# Altium schematic sheet Font.SchDoc
size A4; SheetNumber: 2; SheetTotal: 3
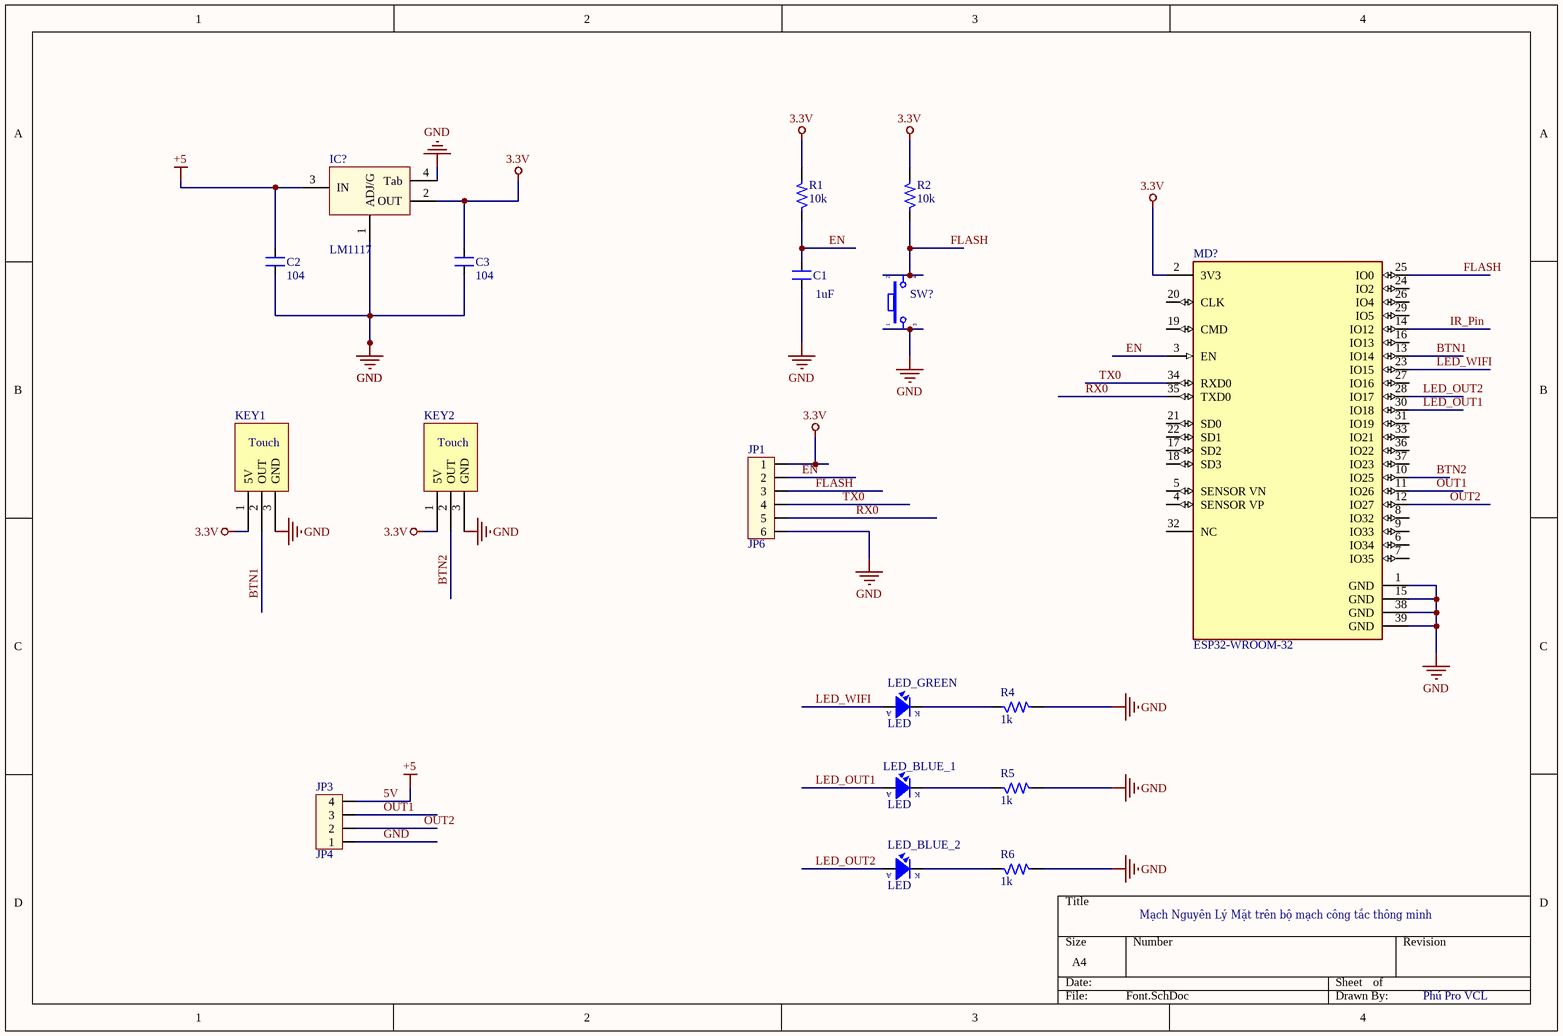
[diagram p0: Font.SchDoc]

## Parts
C1  1uF  [CM-0805]
C2  104  [CM-0805]
C3  104  [CM-0805]
IC?  LM1117  [SOT223-4N]
JP1  JP6  [CON6]
JP3  JP4  [CON4]
KEY1  Component_1  [test]  (value not drawn)
KEY2  Component_1  [test]  (value not drawn)
LED_BLUE_1  LED  [LED_SMD]
LED_BLUE_2  LED  [LED_SMD]
LED_GREEN  LED  [LED_SMD]
MD?  ESP32-WROOM-32  [FP-ESP32-WROOM-32-MFG]
R1  10k  [RM-0805]
R2  10k  [RM-0805]
R4  1k  [RM-0805]
R5  1k  [RM-0805]
R6  1k  [RM-0805]
SW?  SW  [SW4_SMD]  (value not drawn)

## Nets
3.3V: C3.2 IC?.2(OUT) JP1.1 KEY1.1(5V) KEY2.1(5V) MD?.2(3V3) R1.2 R2.2
5V: C2.2 IC?.3(IN) JP3.4  [also labelled +5]
GND: C1.1 C2.1 C3.1 IC?.1(ADJ/G) IC?.4(Tab) JP1.6 JP3.1 KEY1.3(GND) KEY2.3(GND) MD?.1(GND) MD?.15(GND) MD?.38(GND) MD?.39(GND) R4.2 R5.2 R6.2 SW?.1 SW?.3
BTN1: KEY1.2(OUT) MD?.13(IO14)
BTN2: KEY2.2(OUT) MD?.10(IO25)
EN: C1.2 JP1.2 MD?.3(EN) R1.1
FLASH: JP1.3 MD?.25(IO0) R2.1 SW?.2 SW?.4
IR_Pin: MD?.14(IO12)
LED_OUT1: LED_BLUE_1.1(A) MD?.30(IO18)
LED_OUT2: LED_BLUE_2.1(A) MD?.28(IO17)
LED_WIFI: LED_GREEN.1(A) MD?.23(IO15)
OUT1: JP3.3 MD?.11(IO26)
OUT2: JP3.2 MD?.12(IO27)
RX0: JP1.5 MD?.35(TXD0)
TX0: JP1.4 MD?.34(RXD0)
NetLED_BLUE_1_2: LED_BLUE_1.2(K) R5.1
NetLED_BLUE_2_2: LED_BLUE_2.2(K) R6.1
NetLED_GREEN_2: LED_GREEN.2(K) R4.1

Not connected (* = marked no-connect by the designer): MD? 4(SENSOR_VP) 5(SENSOR_VN) 6(IO34) 7(IO35) 8(IO32) 9(IO33) 16(IO13) 17(SD2) 18(SD3) 19(CMD) 20(CLK) 21(SD0) 22(SD1) 24(IO2) 26(IO4) 27(IO16) 29(IO5) 31(IO19) 32(NC) 33(IO21) 36(IO22) 37(IO23)

## Notes on the sheet
- Mạch Nguyên Lý Mặt trên bộ mạch công tắc thông minh
- Phú Pro VCL
- (in symbol Component_1) Touch

## Library data of the parts
C1-C3 = CM: Cap SMD; Value: 103
IC? = LM1117: 3v3; Value: LM317
JP1 = Con6: Connector 6; Value: Connector 6
JP3 = Con4: Connector 4; Value: Connector 4
LED_BLUE_1 LED_BLUE_2 LED_GREEN = LED: LED Single colour Green and Red; Value: LED 3 ly Single Colour
MD? = CMP-194065-000008-1: RX TXRX MOD WIFI SURFACE MOUNT; Frequency: 2.5GHz; Sensitivity: -98dBm; Operating Supply Voltage: 3.6V; Data Rate: 150Mbps; Weight: 0.088185oz; Package Quantity: 550; Min Operating Temperature: -40°C; Mount: Surface Mount; Max Operating Temperature: 85°C; Packaging: Cut Tape; Case/Package: SMD/SMT
R1 R2 R4-R6 = R: Resistor 1/4W; Value: R1/4W - 1K
SW? = SW4: Switch button 4 pin; Value: Button chip 4 pin